# EAGLE design InstrumentationAmp (EAGLE 8.3.0)

## Sheet 1 of 3
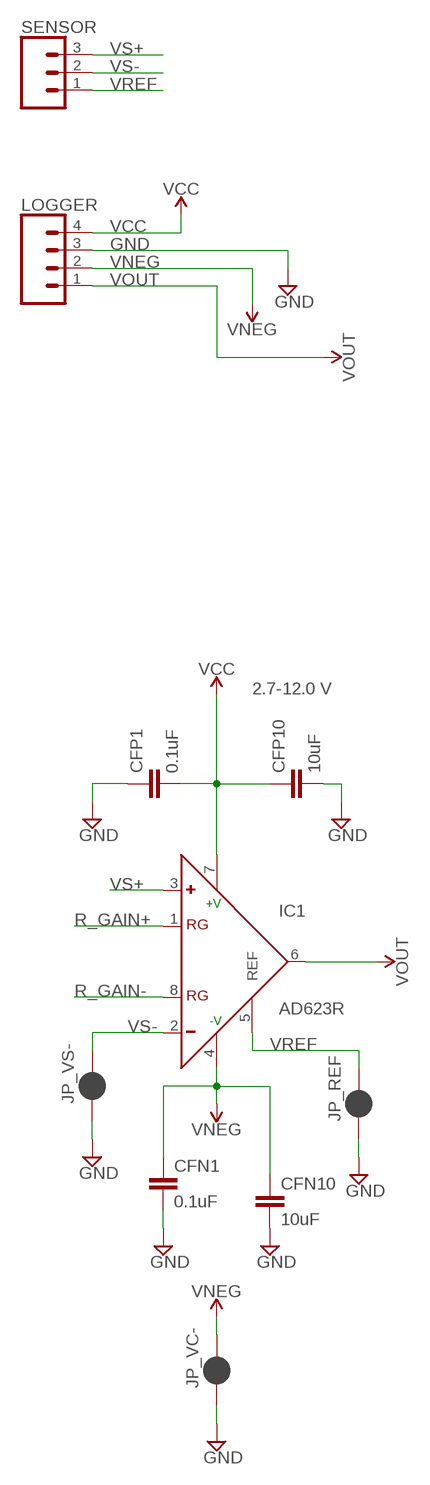
[diagram p0: schematic, sheet 1]

### Parts
CFN1  0.1uF  0.1UF-0603-25V-(+80/-20%)  [0603]
CFN10  10uF  C-EUC0805  [C0805]
CFP1  0.1uF  0.1UF-0603-25V-(+80/-20%)  [0603]
CFP10  10uF  C-EUC0805  [C0805]
IC1  AD623R  [SO8]
JP_REF  JUMPER-SMT_2_NC_PASTE_SILK  [SMT-JUMPER_2_NC_PASTE_SILK]
JP_VC-  JUMPER-SMT_2_NC_PASTE_SILK  [SMT-JUMPER_2_NC_PASTE_SILK]
JP_VS-  JUMPER-SMT_2_NC_PASTE_SILK  [SMT-JUMPER_2_NC_PASTE_SILK]
LOGGER  CONN_04  [1X04]
SENSOR  CONN_03  [1X03]

### Nets
GND: CFN1.2 CFN10.2 CFP1.1 CFP10.2 JP_REF.1 JP_VC-.1 JP_VS-.1 LOGGER.3 ; also sheet 2,3
R_GAIN+: IC1.1(RG) ; also sheet 2
R_GAIN-: IC1.8(RG) ; also sheet 2
VCC: CFP1.2 CFP10.1 IC1.7(+V) LOGGER.4 ; also sheet 3
VNEG: CFN1.1 CFN10.1 IC1.4(-V) JP_VC-.2 LOGGER.2
VOUT: IC1.6(OUT) LOGGER.1
VREF: IC1.5(REF) JP_REF.2 SENSOR.1
VS+: IC1.3(+) SENSOR.3
VS-: IC1.2(-) JP_VS-.2 SENSOR.2

### Notes on the sheet
- 2.7-12.0 V

## Sheet 2 of 3
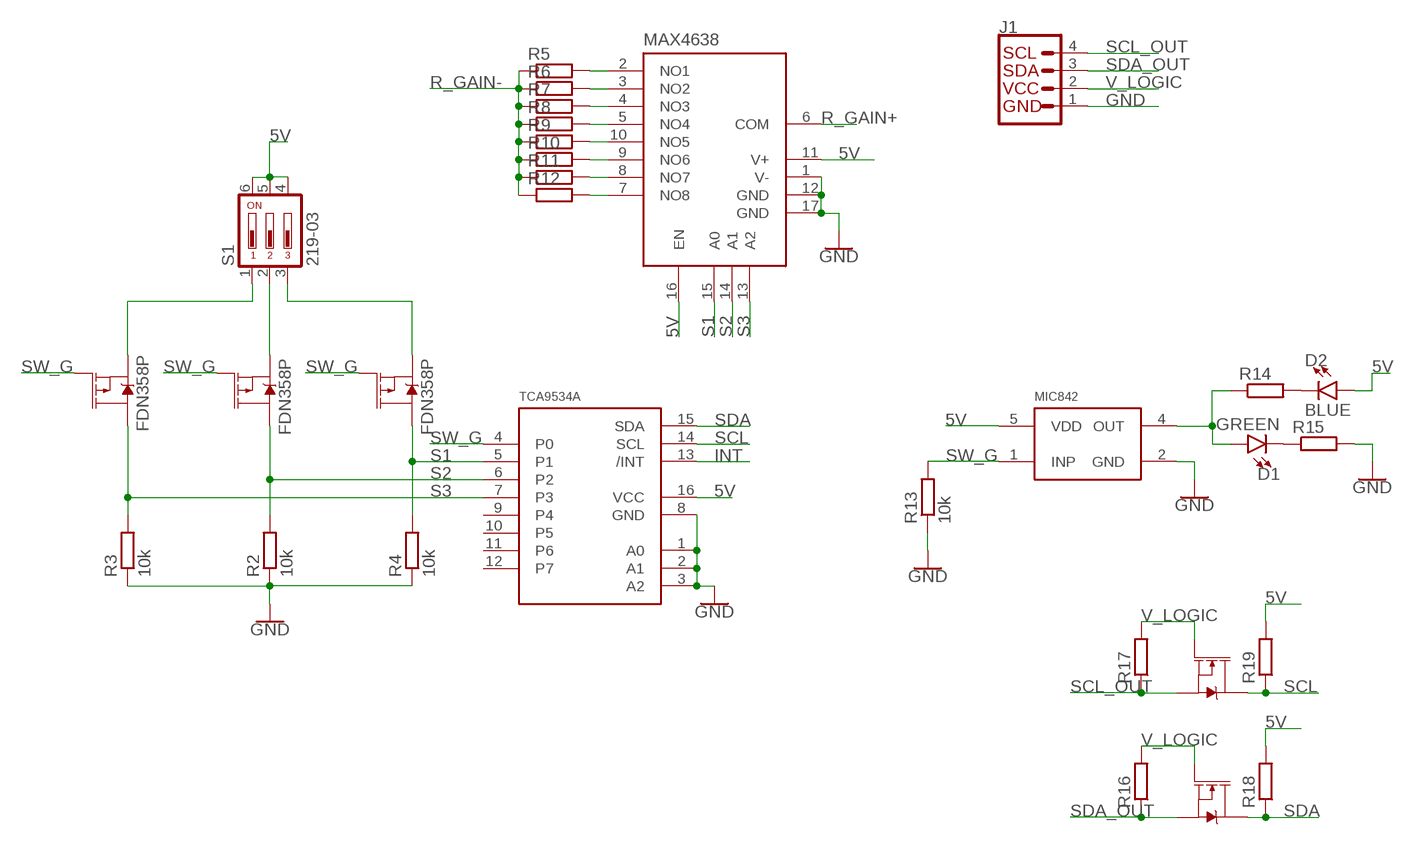
[diagram p1: schematic, sheet 2]

### Parts
D1  GREEN  LED-GREEN0603  [LED-0603]
D2  BLUE  LED-BLUE0603  [LED-0603]
J1  I2C_STANDARD  [1X04]
Q1  310mA/60V/1.6Ω  MOSFET-NCH-2N7002PW  [SOT323]
Q2  310mA/60V/1.6Ω  MOSFET-NCH-2N7002PW  [SOT323]
R2  10k  R-EU_R0603  [R0603]
R3  10k  R-EU_R0603  [R0603]
R4  10k  R-EU_R0603  [R0603]
R5  R-EU_R0603  [R0603]
R6  R-EU_R0603  [R0603]
R7  R-EU_R0603  [R0603]
R8  R-EU_R0603  [R0603]
R9  R-EU_R0603  [R0603]
R10  R-EU_R0603  [R0603]
R11  R-EU_R0603  [R0603]
R12  R-EU_R0603  [R0603]
R13  10k  R-EU_R0603  [R0603]
R14  R-EU_R0603  [R0603]
R15  R-EU_R0603  [R0603]
R16  R-EU_R0603  [R0603]
R17  R-EU_R0603  [R0603]
R18  R-EU_R0603  [R0603]
R19  R-EU_R0603  [R0603]
S1  219-03  [CTS-219-03]
U$1  MAX4638  [TQFN16]
U$2  TCA9534A  [TSSOP16]
U$3  FDN358P  [SSOT-3]
U$4  FDN358P  [SSOT-3]
U$5  FDN358P  [SSOT-3]
U$6  MIC842  [DCK_R-PDSO-G5]

### Nets
5V: D2.A R18.2 R19.2 S1.4 S1.5 S1.6 U$1.11(V+) U$1.16(EN) U$2.16(VCC) U$6.5(VDD) ; also sheet 3
GND: J1.1 R2.1 R3.1 R4.1 R13.1 R15.2 U$1.1(V-) U$1.12(GND) U$1.17(GND) U$2.1(A0) U$2.2(A1) U$2.3(A2) U$2.8(GND) U$6.2(GND) ; also sheet 1,3
INT: U$2.13(/INT)
N$1: S1.2 U$4.2(S)
N$3: D2.C R14.2
N$6: S1.3 U$5.2(S)
N$7: S1.1 U$3.2(S)
N$8: R5.2 U$1.2(NO1)
N$9: R6.2 U$1.3(NO2)
N$11: R7.2 U$1.4(NO3)
N$12: R8.2 U$1.5(NO4)
N$13: R9.2 U$1.10(NO5)
N$14: R10.2 U$1.9(NO6)
N$15: R11.2 U$1.8(NO7)
N$16: R12.2 U$1.7(NO8)
N$17: D1.C R15.1
N$18: D1.A R14.1 U$6.4(OUT)
R_GAIN+: U$1.6(COM) ; also sheet 1
R_GAIN-: R5.1 R6.1 R7.1 R8.1 R9.1 R10.1 R11.1 R12.1 ; also sheet 1
S1: R4.2 U$1.15(A0) U$2.5(P1) U$5.3(D)
S2: R2.2 U$1.14(A1) U$2.6(P2) U$4.3(D)
S3: R3.2 U$1.13(A2) U$2.7(P3) U$3.3(D)
SCL: Q2.3(D) R19.1 U$2.14(SCL)
SCL_OUT: J1.4 Q2.2(S) R17.1
SDA: Q1.3(D) R18.1 U$2.15(SDA)
SDA_OUT: J1.3 Q1.2(S) R16.1
SW_G: R13.2 U$2.4(P0) U$3.1(G) U$4.1(G) U$5.1(G) U$6.1(INP)
V_LOGIC: J1.2 Q1.1(G) Q2.1(G) R16.2 R17.2
Unconnected: U$2.9(P4) U$2.10(P5) U$2.11(P6) U$2.12(P7)

## Sheet 3 of 3
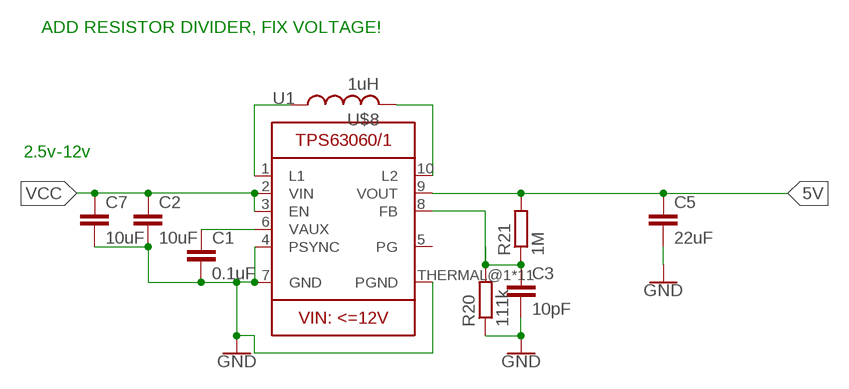
[diagram p2: schematic, sheet 3]

### Parts
C1  0.1uF  C-EUC0603  [C0603]
C2  10uF  C-EU10UFC0805  [C0805]
C3  10pF  C-EUC0603  [C0603]
C5  22uF  C-EU22UFC0805  [C0805]
C7  10uF  C-EU10UFC0805  [C0805]
R20  111k  R-EU_R0603  [R0603]
R21  1M  R-EU_R0603  [R0603]
U1  TPS63061  [PWSON-N10]
U$8  1uH  WE-MAIA(INDUCTOR)  [WE-MAIA(4.1X4.1)]

### Nets
5V: C5.1 R21.2 U1.9(VOUT) ; also sheet 2
GND: C1.2 C2.2 C3.2 C5.2 C7.2 R20.1 U1.4(PSYNC) U1.7(GND) U1.THERMAL@1(PGND) U1.THERMAL@5(PGND) U1.THERMAL@6(PGND) U1.THERMAL@7(PGND) U1.THERMAL@8(PGND) U1.THERMAL@9(PGND) U1.THERMAL@10(PGND) U1.THERMAL@11(PGND) U1.THERMAL@12(PGND) U1.THERMAL@13(PGND) U1.THERMAL@14(PGND) ; also sheet 1,2
N$5: U1.1(L1) U$8.P$1
N$19: C3.1 R20.2 R21.1 U1.8(FB)
N$20: U1.10(L2) U$8.P$2
N$23: C1.1 U1.6(VAUX)
VCC: C2.1 C7.1 U1.2(VIN) U1.3(EN) ; also sheet 1
Unconnected: U1.5(PG)

### Notes on the sheet
- ADD RESISTOR DIVIDER, FIX VOLTAGE!
- 2.5v-12v

## Library data of the parts
C1 C3 = rcl:C-EU: CAPACITOR, European symbol
C2 C7 = bschulz:C-EU: CAPACITOR, European symbol; DIGIKEY: 1276-2405-1-ND; MF: Samsung; MPN: CL21A106KQCLRNC
C5 = bschulz:C-EU: CAPACITOR, European symbol; DIGIKEY: 1276-6687-1-ND; MF: Samsung; MPN: CL21A226KQCLRNC
CFN1 CFP1 = SparkFun-Capacitors:0.1UF: 0.1µF ceramic capacitors A capacitor is a passive two-terminal electrical component used to store electrical energy temporarily in an electric field.; PROD_ID: CAP-00810
CFN10 CFP10 = bschulz:C-EU: CAPACITOR, European symbol
D1 = SparkFun-LED:LED-GREEN: Green SMD LED Used in manufacturing of various products at SparkFun Packages: 0603 - SMD 0603 package [Product Link] <http://www.futureelectronics.com/en/technologies/semiconductors/optoelectronics/leds/Pages/9894312-LTST-C190GKT.aspx?CrossPart=HSMG-C190&IM=0> LilyPad 1206 - SMD1206 LilyPad package [Product Link] <http://www.futureelectronics.com/en/Technologies/Product.aspx?ProductID=IN150NGHARVATEKCORPORATION2049943&IM=0> 1206 - SMD1206 package [Product Link] <http://www.futureelectronics.com/en/technologies/semiconductors/optoelectronics/leds/Pages/8315665-LTST-C150KGKT.aspx?IM=0> 1206 Bottom Mount -SMD 1206 Bottom Mount [Product Link] <http://www.digikey.com/product-detail/en/lite-on-inc/LTST-C230KGKT/160-1456-1-ND/386854> SparkFun Products: Pro Mini 328 -5V <https://www.sparkfun.com/products/821> RedBoard <https://www.sparkfun.com/products/12757> MP3 Trigger <https://www.sparkfun.com/products/13720> Makey Makey <https://www.sparkfun.com/products/11076>; PROD_ID: DIO-00821
D2 = SparkFun-LED:LED-BLUE: Blue SMD LED Used in manufacturing of various products at SparkFun Packages: 0603 - SMD 0603 package [Product Link] <http://www.digikey.com/product-detail/en/SMLE12BC7TT86/511-1589-2-ND/1641808> 1206 - SMD1206 package [Product Link] <http://www.digikey.com/product-detail/en/lite-on-inc/LTST-C150TBKT/160-1643-1-ND/573584> SparkFun Products: ESP8266 Thing-Dev Board <https://www.sparkfun.com/products/13711> RedBoard <https://www.sparkfun.com/products/12757>; PROD_ID: DIO-08575
IC1 = analog-devices:AD623: Single-Supply, Rail-to-Rail, Low Cost Instrumentation Amplifier Source: http://www.analog.com/static/imported-files/data_sheets/AD623.pdf; MPN: AD623ARZ.; OC_FARNELL: 9426213; OC_NEWARK: 31M4186
J1 = SparkFun-Connectors:I2C_STANDARD: SparkFun I2C Standard Pinout Header SparkFun has standardized on a pinout for all I2C based sensor breakouts. This pinout allows I2C boards to be plugged directly into the headers on Arduino Uno compatible boards, and to be daisy chained easily. Example SparkFun Products: SparkFun Atmospheric Sensor Breakout - BME280 <https://www.sparkfun.com/products/13676> SparkFun Altitude/Pressure Sensor Breakout - MPL3115A2 <https://www.sparkfun.com/products/11084> SparkFun TOF Range Finder Sensor - VL6180 <https://www.sparkfun.com/products/12785>
JP_REF JP_VC- JP_VS- = SparkFun-Jumpers:JUMPER-SMT_2_NC_PASTE: Normally closed solder jumper This jumper has an aperture in the stencil to allow solder paste to bridge the split in the wire so it's normally closed (NC). Wick off the solder to open the connection. Reapply solder to reclose the connection.
LOGGER = SparkFun-Connectors:CONN_04: Multi connection point. Often used as Generic Header-pin footprint for 0.1 inch spaced/style header connections On any of the 0.1 inch spaced packages, you can populate with these: Break Away Headers - Straight <https://www.sparkfun.com/products/116> (PRT-00116) Break Away Male Headers - Right Angle <https://www.sparkfun.com/products/553> (PRT-00553) Female Headers <https://www.sparkfun.com/products/115> (PRT-00115) Break Away Headers - Machine Pin <https://www.sparkfun.com/products/117> (PRT-00117) Break Away Female Headers - Swiss Machine Pin <https://www.sparkfun.com/products/743> (PRT-00743) For SCREWTERMINALS and SPRING TERMINALS visit here: Screw Terimnals on SparkFun.com <https://www.sparkfun.com/search/results?term=Screw+Terminals> (5mm/3.5mm/2.54mm spacing) This device is also useful as a general connection point to wire up your design to another part of your project. Our various solder wires solder well into these plated through hole pads. Hook-Up Wire - Assortment (Stranded, 22 AWG) <https://www.sparkfun.com/products/11375> (PRT-11375) Hook-Up Wire - Assortment (Solid Core, 22 AWG) <https://www.sparkfun.com/products/11367> (PRT-11367) View the entire wire category on our website here <https://www.sparkfun.com/categories/141> Special notes: Molex polarized connector foot print use with SKU : PRT-08231 with associated crimp pins and housings. 1MM SMD Version SKU: PRT-10208; PROD_ID: CONN-09696
Q1 Q2 = SparkFun-DiscreteSemi:MOSFET-NCH: N-channel MOSFETs Voltage controlled devices that allow control of high current outputs. SparkFun Products: SparkFun OpenScale <https://www.sparkfun.com/products/13261> SparkFun Digital Sandbox <https://www.sparkfun.com/products/12651> SparkFun Monster Moto Shield <https://www.sparkfun.com/products/10182> SparkFun MOSFET Power Controller <https://www.sparkfun.com/products/11214>; PROD_ID: TRANS-11151
R2-R21 = rcl:R-EU_: RESISTOR, European symbol
S1 = switch-dil:219-03*: Surface Mount DIP Switch Series 219 SMT CTS Electronic Components Sourc: www.ctscorp.com; OC_FARNELL: unknown; OC_NEWARK: unknown
SENSOR = SparkFun-Connectors:CONN_03: Multi connection point. Often used as Generic Header-pin footprint for 0.1 inch spaced/style header connections On any of the 0.1 inch spaced packages, you can populate with these: Break Away Headers - Straight <https://www.sparkfun.com/products/116> (PRT-00116) Break Away Male Headers - Right Angle <https://www.sparkfun.com/products/553> (PRT-00553) Female Headers <https://www.sparkfun.com/products/115> (PRT-00115) Break Away Headers - Machine Pin <https://www.sparkfun.com/products/117> (PRT-00117) Break Away Female Headers - Swiss Machine Pin <https://www.sparkfun.com/products/743> (PRT-00743) Stackable Header - 3 Pin (Female, 0.1") <https://www.sparkfun.com/products/13875> (PRT-13875) For SCREWTERMINALS and SPRING TERMINALS visit here: Screw Terimnals on SparkFun.com <https://www.sparkfun.com/search/results?term=Screw+Terminals> (5mm/3.5mm/2.54mm spacing) This device is also useful as a general connection point to wire up your design to another part of your project. Our various solder wires solder well into these plated through hole pads. Hook-Up Wire - Assortment (Stranded, 22 AWG) <https://www.sparkfun.com/products/11375> (PRT-11375) Hook-Up Wire - Assortment (Solid Core, 22 AWG) <https://www.sparkfun.com/products/11367> (PRT-11367) View the entire wire category on our website here <https://www.sparkfun.com/categories/141> Special notes: Molex polarized connector foot print use with SKU : PRT-08232 with associated crimp pins and housings.
U1 = bschulz:TPS6306*: TPS6306x - Step Up/Down Converter (Buck-Boost) Characteristics: Vin: 2.5V ~ 12V Vout: 2.5V ~ 8V (or 5V fixed) Output Current: 2 A Operating Temperature: -40°C to 85°C Digikey: TPS63061 (5V Fixed) <https://www.digikey.com/product-detail/en/texas-instruments/TPS63061DSCR/296-30205-1-ND/2834997> TPS63060 (Adjustable) <https://www.digikey.com/product-detail/en/texas-instruments/TPS63060DSCR/296-30204-1-ND/2834996>; DIGIKEY: 296-30205-1-ND; MF: TI; MPN: TPS63061DSCR
U$1 = Custom:MAX4638: Mutiplexer, single 8:1, 3.5 ohm, low voltage
U$2 = Custom:TCA9534A: IO Expander, I2C, 3.3V and 5V compatable, 8 input/output, intterupt pin drive
U$3-U$5 = Custom:FDN358P: MOSFET P-type, 1.5A, 30V, Rdson = 125mOhms, Vgs(max) = 3V, Vgs(typ) = 1.9V
U$6 = Custom:MIC842: Comparator with internal voltage referance (1.24V), 5V and 3.3V compatable, 20mA output current
U$8 = Custom:WE-MAIA(INDUCTOR): Wurth MAIA series inductor (https://www.digikey.com/products/en?FV=ffecb9d7,ffe00047)

## Net classes
0 default: width 0.203 mm, drill 0.305 mm

## Board
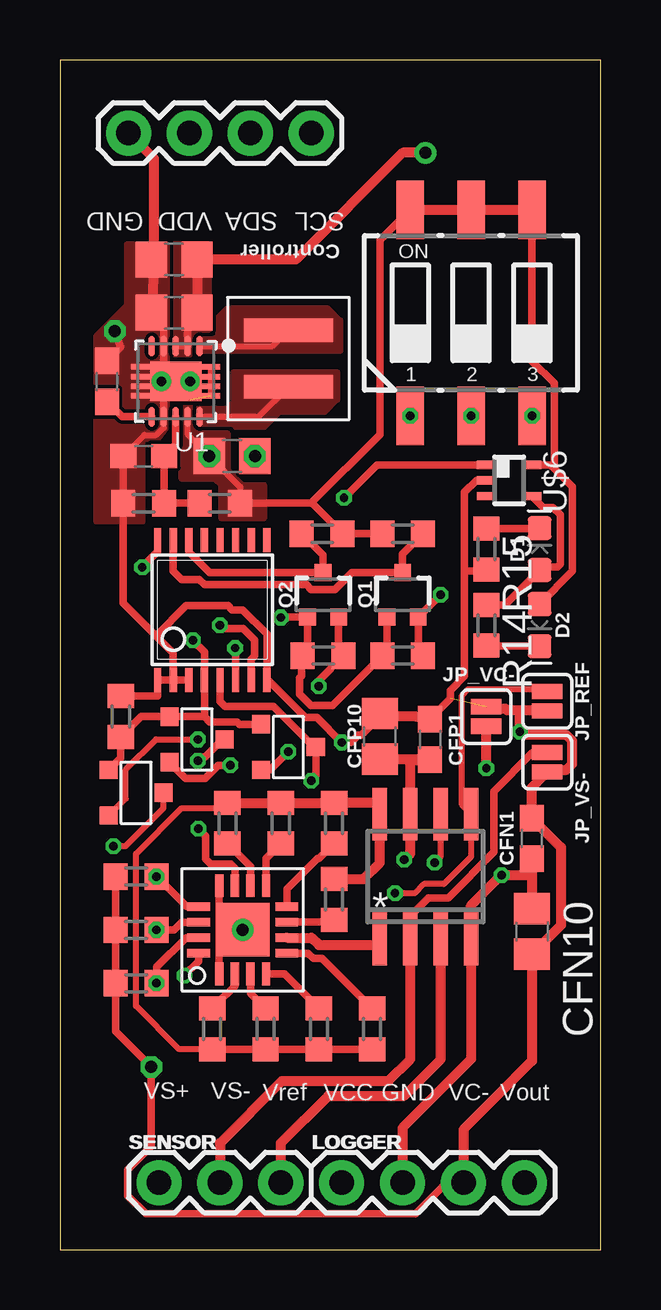
[diagram p3: board, top side]
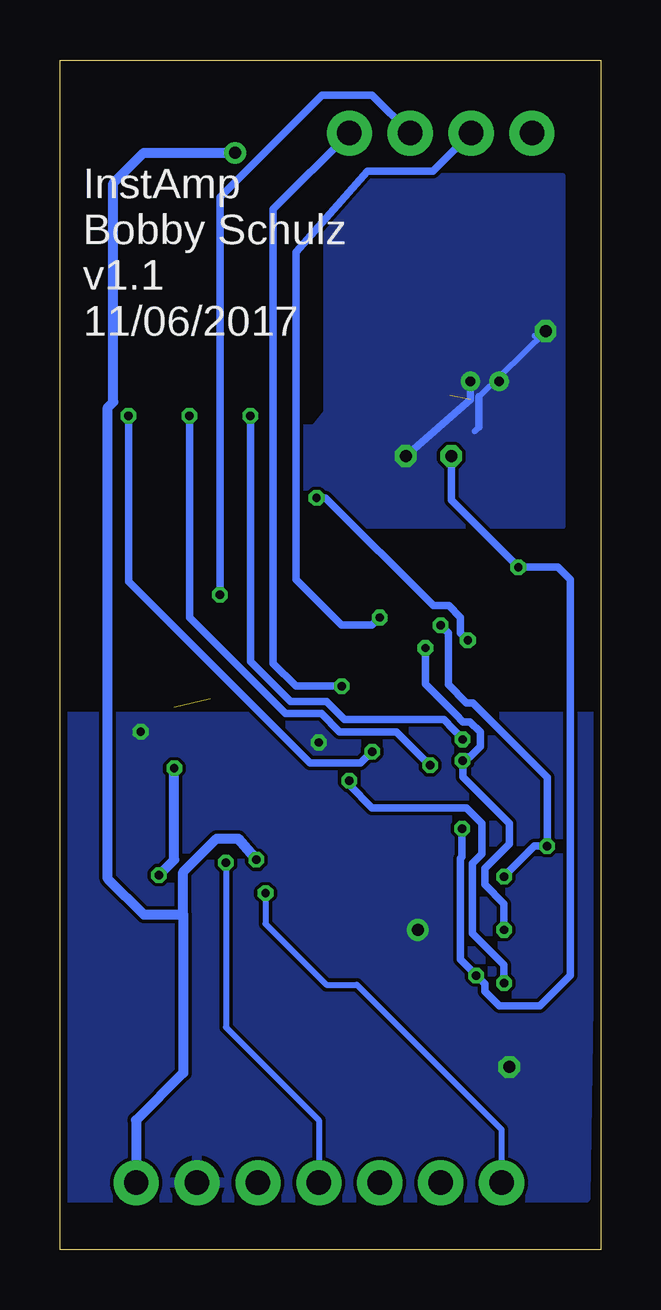
[diagram p4: board, bottom side, seen from below]

Size 22.54 x 49.59 mm. Coordinates in mm from the lower left corner, seen from the top.
Outline: 0,0 22.54,0 22.54,49.59 0,49.59 0,0
Copper layers (1*16): Top 0.035mm / dielectric 1.5mm / Bottom 0.035mm
Design rules "PCB-POOL Standard": minimum track width 0.15mm, minimum drill 0.3mm, track to track 0.15mm, track to pad 0.15mm, pad to pad 0.15mm, via to via 0.15mm, smd to smd 0.15mm, copper to edge 0.3mm, drill to drill 0.2mm, minimum pad ring 0.2mm, minimum via ring 0.15mm, stop-mask expansion 0.075mm, vias tented up to drill 0mil, thermal gap 0.2mm
tKeepout: area 2.5,-0.1 to 21,6; area 0.4,43.3 to 13.1,49.8

### Footprints (pad centres in the part's own frame; a part is rotated, then mirrored left to right if it is on the bottom)
C0603 = smd 1.1 x 1: 1 -0.85,0; 2 0.85,0
C0805 = smd 1.3 x 1.5: 1 -0.95,0; 2 0.95,0
0603 = smd 1.1 x 1: 1 -0.85,0; 2 0.85,0
LED-0603 = smd 1 x 1: A -0.877,0; C 0.877,0
SO8 = smd 0.6 x 2.2: 1 -1.905,-2.6; 2 -0.635,-2.6; 3 0.635,-2.6; 4 1.905,-2.6; 5 1.905,2.6; 6 0.635,2.6; 7 -0.635,2.6; 8 -1.905,2.6
1X04 = drill 1.016 pad 1.88: 1 0,0; 2 2.54,0; 3 5.08,0; 4 7.62,0
SMT-JUMPER_2_NC_PASTE_SILK = smd 0.635 x 1.27: 1 -0.406,0; 2 0.406,0
SOT323 = smd 0.7 x 0.7: 1 -0.65,-0.925; 2 0.65,-0.925; 3 0,0.925
R0603 = smd 1 x 1.1: 1 -0.85,0; 2 0.85,0
CTS-219-03 = smd 1.13 x 2.44: 1 -2.54,-4.3; 2 0,-4.3; 3 2.54,-4.3; 4 2.54,4.3; 5 0,4.3; 6 -2.54,4.3
1X03 = drill 1.016 pad 1.88: 1 0,0; 2 2.54,0; 3 5.08,0
PWSON-N10 = smd 0.28 x 0.85: 1 -1,-1.475; 2 -0.5,-1.475; 3 0,-1.475; 4 0.5,-1.475; 5 1,-1.475; 6 1,1.475; 7 0.5,1.475; 8 0,1.475; 9 -0.5,1.475; 10 -1,1.475 | smd 2.15 x 1.66: THERMAL@1 0,0 | drill 0.4 pad 0.6: THERMAL@5 -0.6,0; THERMAL@6 0.6,0 | smd 0.8 x 0.23: THERMAL@7 1.46,0.6; THERMAL@8 1.46,0.2; THERMAL@9 1.46,-0.2; THERMAL@10 1.46,-0.6; THERMAL@11 -1.46,-0.6; THERMAL@12 -1.46,-0.2; THERMAL@13 -1.46,0.2; THERMAL@14 -1.46,0.6
TQFN16 = smd 0.95 x 0.35: 1 -1.84,0.975; 2 -1.84,0.325; 3 -1.84,-0.325; 4 -1.84,-0.975; 9 1.84,-0.975; 10 1.84,-0.325; 11 1.84,0.325; 12 1.84,0.975 | smd 0.35 x 0.95: 5 -0.975,-1.84; 6 -0.325,-1.84; 7 0.325,-1.84; 8 0.975,-1.84; 13 0.975,1.84; 14 0.325,1.84; 15 -0.325,1.84; 16 -0.975,1.84 | smd 2.23 x 2.23: 17 0,0
TSSOP16 = smd 0.305 x 0.991: 1 -2.275,-2.918; 2 -1.625,-2.918; 3 -0.975,-2.918; 4 -0.325,-2.918; 5 0.325,-2.918; 6 0.975,-2.918; 7 1.625,-2.918; 8 2.275,-2.918; 9 2.275,2.918; 10 1.625,2.918; 11 0.975,2.918; 12 0.325,2.918; 13 -0.325,2.918; 14 -0.975,2.918; 15 -1.625,2.918; 16 -2.275,2.918
SSOT-3 = smd 0.76 x 0.76: 1 -0.95,-1.145; 2 0.95,-1.145; 3 0,1.145
DCK_R-PDSO-G5 = smd 0.35 x 0.8: 1 -0.65,-0.95; 2 0,-0.95; 3 0.65,-0.95; 4 0.65,0.95; 5 -0.65,0.95
WE-MAIA(4.1X4.1) = smd 0.98 x 3.7: P$1 -1.185,0; P$2 1.185,0

### Placement (x,y rotation side)
C1  1.97,36.2 90 top
C2  4.76,39.05 180 top
C3  3.49,33.08 180 top
C5  7.18,33.08 0 top
C7  4.76,41.28 180 top
CFN1  19.68,17.14 90 top
CFN10  19.68,13.27 270 top
CFP1  15.43,21.27 270 top
CFP10  13.33,21.4 90 top
D1  20,29.21 90 top
D2  20,26.04 270 top
IC1  15.24,15.56 0 top
J1  2.86,46.55 0 top
JP_REF  20.32,22.86 90 top
JP_VC-  17.78,22.22 270 top
JP_VS-  20.32,20.32 90 top
LOGGER  11.75,2.79 0 top
Q1  14.29,27.3 0 top
Q2  10.97,27.3 0 top
R2  3.17,13.33 0 top
R3  3.17,15.56 0 top
R4  3.17,11.11 0 top
R5  6.35,9.21 90 top
R6  8.57,9.21 90 top
R7  10.79,9.21 90 top
R8  13.02,9.21 90 top
R9  6.98,17.78 270 top
R10  9.21,17.78 270 top
R11  11.43,17.78 270 top
R12  11.43,14.61 270 top
R13  2.54,22.22 270 top
R14  17.78,26.04 270 top
R15  17.78,29.21 270 top
R16  14.29,24.77 180 top
R17  10.97,24.77 180 top
R18  14.29,29.84 180 top
R19  10.93,29.84 0 top
R20  3.49,31.11 0 top
R21  6.67,31.11 0 top
S1  17.14,39.05 0 top
SENSOR  4.13,2.79 0 top
U1  4.83,36.2 180 top
U$1  7.62,13.33 90 top
U$2  6.35,26.67 0 top
U$3  3.17,19.05 270 top
U$4  5.71,21.27 270 top
U$5  9.53,20.95 270 top
U$6  18.73,32.07 270 top
U$8  9.53,37.15 270 top

### Tracks (layer width: path | path; a pad name or v marks a point on that pad's centre or on a via)
5V  (via drill 0.35, 0.5)
  Top 0.254: U1.9 5.33,33.98 C5.1 7.52,31.79 R21.2
  Top 0.305: 5.82,32.82 C5.1 | R18.2 R19.2 10.51,31.11 10.48,31.11 | R21.2 10.48,31.11 | 19.68,32.7 U$6.5 20.46,32.72 20.61,32.57 | D2.A 21.37,28.28 21.37,31.81 20.61,32.57 | 10.48,31.11 13.33,33.97 13.33,42.08 S1.6 | S1.4 19.68,37.04 20.61,36.12 20.61,32.57 | U$1.11 7.29,15.9 7.12,16.07 6.29,16.07 6.08,16.28 6.08,17.25 v5.78,17.55 | v5.18,11.43 5.78,12.03 U$1.16 | 4.08,29.47 U$2.16 4.08,29.09 v3.43,28.45
  Top 0.406: S1.6 S1.5 S1.4
  Bottom 0.305: v5.78,17.55 5.78,16.39 5.85,16.31 5.85,12.1 v5.18,11.43 4.83,11.08 4.83,10.78 4.22,10.16 2.54,10.16 1.27,11.43 1.27,27.94 1.78,28.45 v3.43,28.45 6.22,31.24 C5.1
  other vias: 6.23,33.08
  pour Top (rank 2, no thermals): 5.08,35.18 5.46,35.18 5.46,34.29 5.71,34.04 6.98,34.04 6.98,32.51 7.62,31.88 8.51,31.88 8.51,30.48 6.73,30.48 6.73,31.88 6.48,32.13 5.08,32.13
GND  (via drill 0.35, 0.5)  (2 unrouted)
  Top 0.254: CFN1.2 19.68,17.98 19.68,17.91 | 17.91,22.48 17.78,22.61 JP_VC-.1 | 20.32,22.48 JP_REF.1 | 14.86,22.22 CFP1.1 | CFP10.2 13.33,22.22 | C3.2 3.52,33.97 4.02,33.97 4.33,34.27 4.33,35.03 | U1.THERMAL@11 U1.THERMAL@12 U1.THERMAL@13 U1.THERMAL@14
  Top 0.305: U$1.12 6.64,13.33 | U$1.1 6.64,13.33 | 6.64,13.33 U$1.17 7.62,12.7 | C3.2 R20.1 2.64,26.95 4,25.59 | R3.1 R2.1 R4.1 2.33,9.11 v3.81,7.62 3.81,4.31 2.83,3.33 2.83,2.26 3.59,1.5 14.82,1.5 16.12,2.79 LOGGER.3 | R13.1 4.08,23.07 U$2.1 U$2.2 | U$2.2 U$2.3 | 17.57,28.57 R15.2 17.7,28.28 16.87,28.28 | 16.87,28.28 16.87,31.59 17.36,32.07 U$6.2 | U$2.2 4.72,24.87 4,25.59 | 4,25.59 5.25,26.84 7,26.84 7.18,26.67 7.62,26.67 8.62,25.66 U$2.8 8.68,23.75 10.25,22.18 10.71,22.18 v11.75,21.14 12.13,21.14 12.44,21.45 12.56,21.45 13.33,22.22 | C2.2 4.33,38.64 U1.4 4.33,36.3 U1.THERMAL@6 4.33,36.1 4.33,35.03 U1.7 | v2.29,38.29 2.54,37.62 C1.2 | CFP1.1 16.28,22.97 16.28,23.31 16.87,23.91 16.87,28.28
  Top 0.406: CFN10.2 20.89,13.53 20.89,16.78 19.68,17.98 | 20.32,22.48 19.18,22.48 | 14.86,22.22 13.33,22.22 | 19.18,22.48 v19.18,21.59 19.32,21.45 21.12,21.45 21.36,21.21 21.36,20.24 21.12,20 20.41,20 JP_VS-.1 19.68,19.28 CFN1.2 | CFN10.2 | CFN10.2 19.68,7.87 16.83,5.02 LOGGER.3 | 3.91,40.98 C2.2 | 3.91,40.98 C7.2 | J1.1 3.91,45.49 3.91,40.98 | 19.18,22.48 18.65,22.48 18.58,22.54 17.84,22.54 17.78,22.61
  Bottom 0.254: 2.75,38.1 v2.29,38.29 5.08,35.56 | 5.08,34.29 5.25,34.12
  Bottom 0.305: 5.08,35.56 5.08,34.29 | C5.2 5.43,35.43 U1.THERMAL@5
  other vias: 7.62,13.33 8.13,33.08
  pour Bottom: 0.32,22.22 0.64,2.16 22.86,2.16 22.54,22.22
  pour Bottom (no thermals): 1.59,44.77 1.59,30.16 12.38,30.16 12.38,34.29 11.94,34.29 11.43,34.93 11.43,44.77
  pour Top (no thermals): 4.45,41.91 4.45,34.29 4.06,33.78 3.43,33.78 3.43,30.35 1.52,30.35 1.52,38.1 2.79,39.37 2.79,41.91
N$1  (via drill 0.35)
  Top 0.305: v7.11,20.19 6.59,20.19 6.05,19.65 5.24,19.65 U$4.2
  Bottom 0.305: v7.11,20.19 8.51,21.59 10.88,21.59 11.64,22.35 13.14,22.35 17.14,26.35 S1.2
  other vias: 17.14,34.75
N$3
  Top 0.305: D2.C 17.81,25.16 R14.2
N$5
  Top 0.254: U1.1 8.86,37.67 U$8.P$1
  pour Top (rank 3, no thermals): 5.71,38.23 5.97,38.23 6.98,39.24 11.18,39.24 11.68,38.74 11.68,37.47 5.71,37.47
N$6  (via drill 0.35)
  Top 0.305: v9.53,20.76 8.77,20 U$5.2
  Bottom 0.305: S1.3 19.68,27.86 12.11,20.28 10.01,20.28 v9.53,20.76
  other vias: 19.68,34.75
N$7  (via drill 0.35)
  Top 0.254: U$3.2 2.74,18.81 2.74,20.01 4,21.27 v5.75,21.27
  Bottom 0.305: S1.1 14.61,24.53 12.93,22.86 11.43,22.86 10.67,22.1 6.54,22.1 v5.75,21.27
  other vias: 14.61,34.75
N$8
  Top 0.305: R5.2 6.96,10.66 6.97,10.66 7.29,10.99 U$1.2
N$9
  Top 0.305: R6.2 7.95,10.68 U$1.3
N$11
  Top 0.305: U$1.4 9.36,11.49 R7.2
N$12
  Top 0.305: U$1.5 10.34,12.36 10.56,12.14 10.93,12.14 R8.2
N$13
  Top 0.305: R9.2 7.95,15.97 U$1.10
N$14
  Top 0.305: R10.2 8.6,16.32 U$1.9
N$15
  Top 0.305: R11.2 10.81,16.31 10.73,16.31 9.46,15.04 U$1.8
N$16
  Top 0.305: 11.33,13.66 U$1.7
  Top 0.406: R12.2 11.33,13.66
N$17
  Top 0.305: R15.1 19.98,30.06 D1.C
N$18
  Top 0.305: R14.1 18.55,26.88 D1.A 20,28.46 20.75,28.46 20.86,28.57 20.86,30.65 20.56,30.94 20.16,30.94 U$6.4
N$19
  Top 0.305: R21.1 R20.2 C3.1 4.83,33.57 U1.8
N$20
  Top 0.254: U1.10 8.28,34.72 U$8.P$2
  pour Top (rank 3, no thermals): 5.71,35.05 6.98,35.05 7.24,35.31 7.24,36.58 11.56,36.58 11.56,35.43 11.05,34.93 9.14,34.93 8.51,34.29 5.71,34.29
N$23
  Top 0.305: U1.6 2.59,34.72 C1.1
R_GAIN+
  Top 0.406: U$1.6 10.48,13.01 10.79,12.7 13.33,12.7 IC1.1
R_GAIN-
  Top 0.254: R5.1 4.98,8.36 3.17,10.16 3.17,16.51 5.08,18.41 6.77,18.41
  Top 0.305: R8.1 R7.1 R6.1 R5.1
  Top 0.406: 6.77,18.41 R9.1 R10.1 R11.1 13.33,18.63 IC1.8 13.33,16.13 12.66,15.46 R12.1
S1  (via drill 0.35)
  Top 0.305: R4.2 4.03,11.78 5.25,13.01 U$1.15 | U$2.5 6.68,22.87 6.67,22.86 6.89,22.64 8.91,22.64 10.59,20.95 U$5.3 10.67,19.74 v10.48,19.55
  Bottom 0.305: R4.2 4.03,11.87 5.34,13.19 5.34,16.1 4.95,16.49 4.95,17.78 5.59,18.41 9.53,18.41 10.48,19.37 v10.48,19.55
  other vias: 4.03,11.11
S2  (via drill 0.35)
  Top 0.305: 4.35,13.66 R2.2 4.76,13.33 5.08,13.65 U$1.14 | v7.3,25.08 7.32,24.74 U$2.6 | v5.75,20.38 5.9,20.54 6.05,20.54 6.78,21.27 U$4.3
  Bottom 0.305: R2.2 4.03,14.41 4.83,15.22 4.83,15.89 3.81,16.92 3.81,17.78 5.75,19.72 v5.75,20.38 5.59,20.54 5.44,20.54 5.01,20.97 5.01,21.58 5.44,22.01 5.74,22.01 6.03,22.31 6.18,22.46 7.3,23.58 v7.3,25.08
  other vias: 4.03,13.33
S3  (via drill 0.35)
  Top 0.254: v2.22,16.83 2.73,16.83 4.32,18.41 U$3.3
  Top 0.305: R3.2 5.27,14.31 U$1.13 | U$2.7 7.97,24.61 8.11,24.75 8.11,25.42 7.64,25.89 6.81,25.89 v6.67,26.04
  Bottom 0.305: R3.2 2.75,16.83 v2.22,16.83 2.22,19.68 5.33,22.8 5.59,22.8 6.35,23.56 6.35,25.72 v6.67,26.04
  other vias: 4.03,15.56
SCL
  Top 0.305: 9.76,29.53 R19.1 10.97,28.95 Q2.3 6.23,28.23 5.38,29.09 U$2.14
SCL_OUT  (via drill 0.35)
  Top 0.305: Q2.2 11.62,24.77 R17.1 10.79,23.73 v10.79,23.5
  Bottom 0.305: v10.79,23.5 12.7,23.5 13.65,24.45 13.65,43.37 J1.4
SDA
  Top 0.305: R18.1 14.29,29 Q1.3 12.18,28.23 11.47,27.52 10.48,27.52 10.28,27.72 6.02,27.72 5.8,27.94 5.08,27.94 4.72,28.29 U$2.15
SDA_OUT  (via drill 0.35)
  Top 0.305: R16.1 14.94,24.77 Q1.2 v15.88,27.3
  Bottom 0.305: v15.88,27.3 15.88,43.88 11.62,48.13 9.53,48.13 J1.3
SW_G  (via drill 0.35)
  Top 0.305: U$3.1 2.54,20.51 R13.2 3.39,22.22 U$4.1 6.03,22.22 | 6.03,22.22 U$2.4 6.03,24.91 v5.53,25.4 | U$5.1 7.49,21.91 7.39,22.01 6.24,22.01 6.03,22.22 | U$6.1 13.22,32.72 v11.84,31.34
  Bottom 0.305: v11.84,31.34 11.47,31.34 6.98,26.84 6.33,26.84 5.84,26.35 5.84,25.71 v5.53,25.4
V_LOGIC  (via drill 0.35)
  Top 0.305: Q1.1 13.64,24.77 R16.2 11.36,22.69 10.46,22.69 9.99,23.16 9.99,23.83 10.06,23.91 10.06,24.7 arc-90 R17.2 10.32,24.77 Q2.1 9.23,26.38 v9.21,26.35
  Bottom 0.305: J1.2 6.98,44.96 9.71,44.96 12.7,41.59 12.7,27.94 10.79,26.04 9.53,26.04 v9.21,26.35
VCC  (via drill 0.35, 0.5)
  Top 0.254: CFP10.1 | IC1.7 | U1.3 U1.2 | CFP1.2 14.86,20.45 14.86,20.32 CFP1.2
  Top 0.305: U1.2 5.33,38.77 C2.1
  Top 0.406: 14.86,20.45 CFP10.1 | v14.35,16.26 14.61,16.51 IC1.7 14.61,20.42 CFP1.2 | 5.58,39.05 C2.1 C7.1 9.84,41.28 14.29,45.72 v15.24,45.72
  Bottom 0.406: v14.35,16.26 15.11,17.14 16,17.14 17.4,15.75 17.4,13.97 | 17.4,13.97 17.4,7.37 19.37,5.4 LOGGER.4 | v15.24,45.72 19.05,45.72 20.32,44.45 20.32,35.33 20.54,35.11 20.54,15.46 19.05,13.97 17.4,13.97
  pour Top (rank 2, no thermals): 4.7,41.91 4.7,37.34 5.46,37.34 5.46,38.1 5.71,38.35 6.22,38.35 6.22,41.91
VNEG  (via drill 0.35)
  Top 0.254: 17.14,13.08 IC1.4 17.14,12.19
  Top 0.406: CFN1.1 19.68,15.62 | 19.68,15.62 CFN10.1 | v17.78,20.07 JP_VC-.2 | 19.68,15.62 v18.41,15.62 17.14,14.35 17.14,13.08 | IC1.4 17.14,7.94 14.29,5.08 LOGGER.2
  Bottom 0.406: v17.78,20.07 17.78,16.26 v18.41,15.62
VOUT  (via drill 0.35)
  Top 0.254: IC1.6 15.88,16.38 v15.62,16.13
  Bottom 0.254: v15.62,16.13 15.62,9.27 11.75,5.4 LOGGER.1
VREF  (via drill 0.35)
  Top 0.254: JP_REF.2 20.32,23.37 17.02,23.37 16.76,23.11 16.76,18.54 IC1.5 17.14,16.38 16,15.24 15.18,15.24 14.79,14.86 v13.97,14.86
  Bottom 0.254: v13.97,14.86 13.97,13.59 11.43,11.05 10.16,11.05 4.13,5.02 SENSOR.1
VS+
  Top 0.406: IC1.3 15.88,7.94 14.36,6.43 11.19,6.43 9.21,4.44 SENSOR.3
VS-
  Top 0.254: 14.61,13.91 IC1.2 14.61,12.32 | 20.32,20.7 JP_VS-.2
  Top 0.305: 20.32,20.7 19.68,20.7 18.1,19.11 18.1,16.57 16.19,14.67 15.37,14.67 14.61,13.91
  Top 0.406: IC1.2 14.61,7.94 13.7,7.04 9.26,7.04 6.67,4.44 SENSOR.2

### Text on the board
tPlace: *
tSilk: GND | VDD | SDA | SCL | Controller | VS+ | VS- | Vref | VCC | GND | VC- | Vout | SENSOR | LOGGER
_bsilk: InstAmp / Bobby Schulz / v1.1 / 11/06/2017